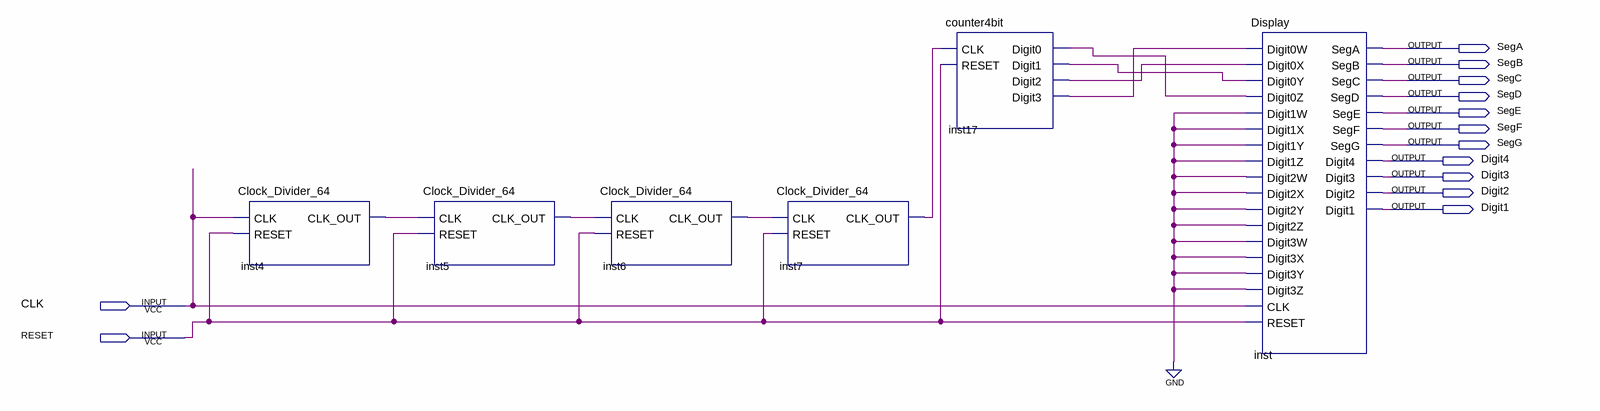
[diagram p0: schematic sheet]
// Quartus schematic displayCounter.bdf as structural Verilog: 6 symbols, 13 pins
module displayCounter (
  input  CLK,
  input  RESET,
  output SegA,
  output SegB,
  output SegC,
  output SegD,
  output SegE,
  output SegF,
  output SegG,
  output Digit4,
  output Digit3,
  output Digit2,
  output Digit1
);

  wire inst4_clk_out, inst5_clk_out, inst6_clk_out, inst7_clk_out, inst17_digit0, inst17_digit1,
       inst17_digit2, inst17_digit3;

  Clock_Divider_64 inst4 (.CLK(CLK), .RESET(RESET), .CLK_OUT(inst4_clk_out));
  Clock_Divider_64 inst5 (.CLK(inst4_clk_out), .RESET(RESET), .CLK_OUT(inst5_clk_out));
  Clock_Divider_64 inst6 (.CLK(inst5_clk_out), .RESET(RESET), .CLK_OUT(inst6_clk_out));
  Clock_Divider_64 inst7 (.CLK(inst6_clk_out), .RESET(RESET), .CLK_OUT(inst7_clk_out));
  counter4bit inst17 (
    .CLK(inst7_clk_out), .RESET(RESET), .Digit0(inst17_digit0), .Digit1(inst17_digit1),
    .Digit2(inst17_digit2), .Digit3(inst17_digit3));
  Display inst (
    .Digit0W(inst17_digit3), .Digit0X(inst17_digit2), .Digit0Y(inst17_digit1), .Digit0Z(inst17_digit0),
    .Digit1W(1'b0), .Digit1X(1'b0), .Digit1Y(1'b0), .Digit1Z(1'b0), .Digit2W(1'b0), .Digit2X(1'b0),
    .Digit2Y(1'b0), .Digit2Z(1'b0), .Digit3W(1'b0), .Digit3X(1'b0), .Digit3Y(1'b0), .Digit3Z(1'b0),
    .CLK(CLK), .RESET(RESET), .SegA(SegA), .SegB(SegB), .SegC(SegC), .SegD(SegD), .SegE(SegE), .SegF(SegF),
    .SegG(SegG), .Digit4(Digit4), .Digit3(Digit3), .Digit2(Digit2), .Digit1(Digit1));
endmodule
